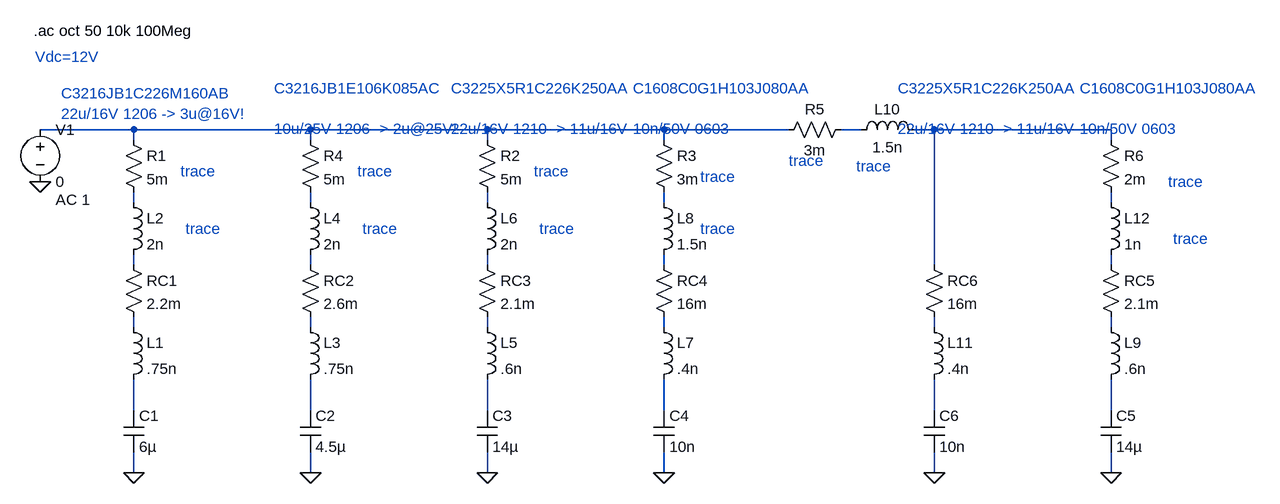
[diagram p0: schematic caps_freq.asc]
caps_freq.asc, the LTspice schematic file:
Version 4
SHEET 1 1900 680
WIRE 112 112 -32 112
WIRE 384 112 112 112
WIRE 656 112 384 112
WIRE 928 112 656 112
WIRE 1120 112 928 112
WIRE 1232 112 1200 112
WIRE 1344 112 1312 112
WIRE 1616 112 1344 112
WIRE 112 128 112 112
WIRE 384 128 384 112
WIRE 656 128 656 112
WIRE 928 128 928 112
WIRE 1616 128 1616 112
WIRE 112 224 112 208
WIRE 384 224 384 208
WIRE 656 224 656 208
WIRE 928 224 928 208
WIRE 1616 224 1616 208
WIRE 112 320 112 304
WIRE 384 320 384 304
WIRE 656 320 656 304
WIRE 928 320 928 304
WIRE 1344 320 1344 112
WIRE 1616 320 1616 304
WIRE 112 416 112 400
WIRE 384 416 384 400
WIRE 656 416 656 400
WIRE 928 416 928 400
WIRE 1344 416 1344 400
WIRE 1616 416 1616 400
WIRE 112 544 112 496
WIRE 384 544 384 496
WIRE 656 544 656 496
WIRE 928 544 928 496
WIRE 1344 544 1344 496
WIRE 1616 544 1616 496
WIRE 112 640 112 608
WIRE 384 640 384 608
WIRE 656 640 656 608
WIRE 928 640 928 608
WIRE 1344 640 1344 608
WIRE 1616 640 1616 608
FLAG -32 192 0
FLAG 112 640 0
FLAG 384 640 0
FLAG 656 640 0
FLAG 928 640 0
FLAG 1616 640 0
FLAG 1344 640 0
SYMBOL voltage -32 96 R0
WINDOW 123 24 124 Left 2
WINDOW 39 0 0 Left 2
SYMATTR InstName V1
SYMATTR Value 0
SYMATTR Value2 AC 1
SYMBOL res 96 304 R0
SYMATTR InstName RC1
SYMATTR Value 2.2m
SYMBOL cap 96 544 R0
SYMATTR InstName C1
SYMATTR Value 6µ
SYMBOL ind 96 400 R0
SYMATTR InstName L1
SYMATTR Value .75n
SYMBOL res 96 112 R0
SYMATTR InstName R1
SYMATTR Value 5m
SYMBOL ind 96 208 R0
SYMATTR InstName L2
SYMATTR Value 2n
SYMBOL res 368 304 R0
SYMATTR InstName RC2
SYMATTR Value 2.6m
SYMBOL cap 368 544 R0
SYMATTR InstName C2
SYMATTR Value 4.5µ
SYMBOL ind 368 400 R0
SYMATTR InstName L3
SYMATTR Value .75n
SYMBOL res 368 112 R0
SYMATTR InstName R4
SYMATTR Value 5m
SYMBOL ind 368 208 R0
SYMATTR InstName L4
SYMATTR Value 2n
SYMBOL res 640 304 R0
SYMATTR InstName RC3
SYMATTR Value 2.1m
SYMBOL cap 640 544 R0
SYMATTR InstName C3
SYMATTR Value 14µ
SYMBOL ind 640 400 R0
SYMATTR InstName L5
SYMATTR Value .6n
SYMBOL res 640 112 R0
SYMATTR InstName R2
SYMATTR Value 5m
SYMBOL ind 640 208 R0
SYMATTR InstName L6
SYMATTR Value 2n
SYMBOL res 912 304 R0
SYMATTR InstName RC4
SYMATTR Value 16m
SYMBOL cap 912 544 R0
SYMATTR InstName C4
SYMATTR Value 10n
SYMBOL ind 912 400 R0
SYMATTR InstName L7
SYMATTR Value .4n
SYMBOL res 912 112 R0
SYMATTR InstName R3
SYMATTR Value 3m
SYMBOL ind 912 208 R0
SYMATTR InstName L8
SYMATTR Value 1.5n
SYMBOL res 1600 304 R0
SYMATTR InstName RC5
SYMATTR Value 2.1m
SYMBOL cap 1600 544 R0
SYMATTR InstName C5
SYMATTR Value 14µ
SYMBOL ind 1600 400 R0
SYMATTR InstName L9
SYMATTR Value .6n
SYMBOL res 1216 96 R90
WINDOW 0 0 56 VBottom 2
WINDOW 3 32 56 VTop 2
SYMATTR InstName R5
SYMATTR Value 3m
SYMBOL ind 1216 128 R270
WINDOW 0 32 56 VTop 2
WINDOW 3 5 56 VBottom 2
SYMATTR InstName L10
SYMATTR Value 1.5n
SYMBOL res 1328 304 R0
SYMATTR InstName RC6
SYMATTR Value 16m
SYMBOL cap 1328 544 R0
SYMATTR InstName C6
SYMATTR Value 10n
SYMBOL ind 1328 400 R0
SYMATTR InstName L11
SYMATTR Value .4n
SYMBOL res 1600 112 R0
SYMATTR InstName R6
SYMATTR Value 2m
SYMBOL ind 1600 208 R0
SYMATTR InstName L12
SYMATTR Value 1n
TEXT -42 -40 Left 2 !.ac oct 50 10k 100Meg
TEXT 0 56 Left 2 ;C3216JB1C226M160AB\n22u/16V 1206 -> 3u@16V!
TEXT 192 264 Left 2 ;trace
TEXT 184 176 Left 2 ;trace
TEXT 464 264 Left 2 ;trace
TEXT 456 176 Left 2 ;trace
TEXT 328 48 Left 2 ;C3216JB1E106K085AC\n\n10u/25V 1206 -> 2u@25V!
TEXT -40 0 Left 2 ;Vdc=12V
TEXT 736 264 Left 2 ;trace
TEXT 728 176 Left 2 ;trace
TEXT 600 48 Left 2 ;C3225X5R1C226K250AA\n\n22u/16V 1210 -> 11u/16V
TEXT 984 264 Left 2 ;trace
TEXT 984 184 Left 2 ;trace
TEXT 880 48 Left 2 ;C1608C0G1H103J080AA\n\n10n/50V 0603
TEXT 1224 168 Left 2 ;trace
TEXT 1120 160 Left 2 ;trace
TEXT 1288 48 Left 2 ;C3225X5R1C226K250AA\n\n22u/16V 1210 -> 11u/16V
TEXT 1712 280 Left 2 ;trace
TEXT 1704 192 Left 2 ;trace
TEXT 1568 48 Left 2 ;C1608C0G1H103J080AA\n\n10n/50V 0603

The netlist it stands for:
* caps_freq.asc
V1 N001 0 0 AC 1
RC1 N009 N014 2.2m
C1 N020 0 6µ
L1 N014 N020 .75n
R1 N001 N004 5m
L2 N004 N009 2n
RC2 N010 N015 2.6m
C2 N021 0 4.5µ
L3 N015 N021 .75n
R4 N001 N005 5m
L4 N005 N010 2n
RC3 N011 N016 2.1m
C3 N022 0 14µ
L5 N016 N022 .6n
R2 N001 N006 5m
L6 N006 N011 2n
RC4 N012 N017 16m
C4 N023 0 10n
L7 N017 N023 .4n
R3 N001 N007 3m
L8 N007 N012 1.5n
RC5 N013 N019 2.1m
C5 N025 0 14µ
L9 N019 N025 .6n
R5 N002 N001 3m
L10 N002 N003 1.5n
RC6 N003 N018 16m
C6 N024 0 10n
L11 N018 N024 .4n
R6 N003 N008 2m
L12 N008 N013 1n
.ac oct 50 10k 100Meg
* C3216JB1C226M160AB
* 22u/16V 1206 -> 3u@16V!
* trace
* trace
* trace
* trace
* C3216JB1E106K085AC
* 10u/25V 1206 -> 2u@25V!
* Vdc=12V
* trace
* trace
* C3225X5R1C226K250AA
* 22u/16V 1210 -> 11u/16V
* trace
* trace
* C1608C0G1H103J080AA
* 10n/50V 0603
* trace
* trace
* C3225X5R1C226K250AA
* 22u/16V 1210 -> 11u/16V
* trace
* trace
* C1608C0G1H103J080AA
* 10n/50V 0603
.backanno
.end

* Results of the author's LTspice run, read from the files saved beside the schematic
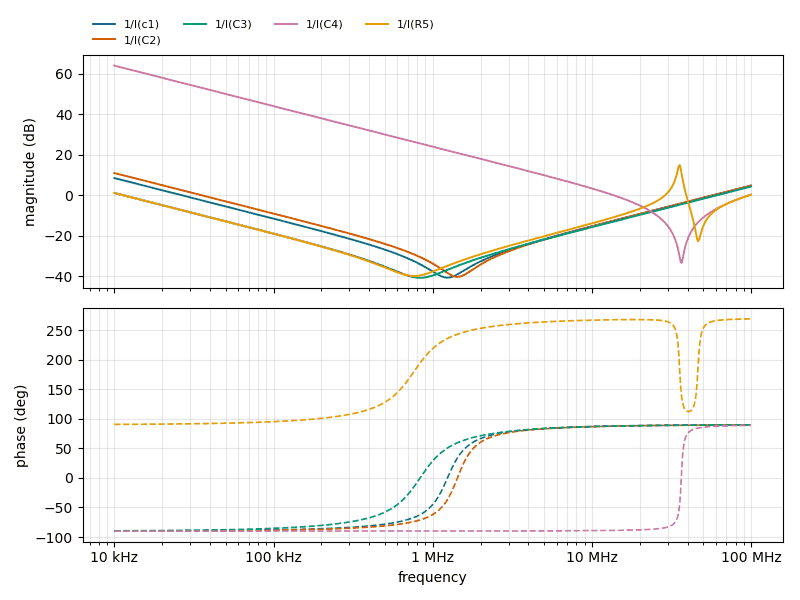
[diagram p1: AC Analysis of caps_freq.asc, plotted from the saved traces]
* AC Analysis, 1 run:
*   1/I(c1): 8.47 dB at 10 kHz, 4.75 dB at 100 MHz, peak 8.47 dB at 10 kHz, 3 dB below the peak at 14.14 kHz
*   1/I(C2): 10.97 dB at 10 kHz, 4.75 dB at 100 MHz, peak 10.97 dB at 10 kHz, 3 dB below the peak at 14.14 kHz
*   1/I(C3): 1.11 dB at 10 kHz, 4.26 dB at 100 MHz, peak 4.26 dB at 100 MHz, 3 dB below the peak at 70.71 MHz
*   1/I(C4): 64.04 dB at 10 kHz, 0.30 dB at 100 MHz, peak 64.04 dB at 10 kHz, 3 dB below the peak at 14.14 kHz
*   1/I(R5): 1.11 dB at 10 kHz, 0.23 dB at 100 MHz, peak 14.86 dB at 35.66 MHz, 3 dB below the peak at 34.54 MHz and 36.41 MHz